# EAGLE design DS2408_8S (EAGLE 6.1)
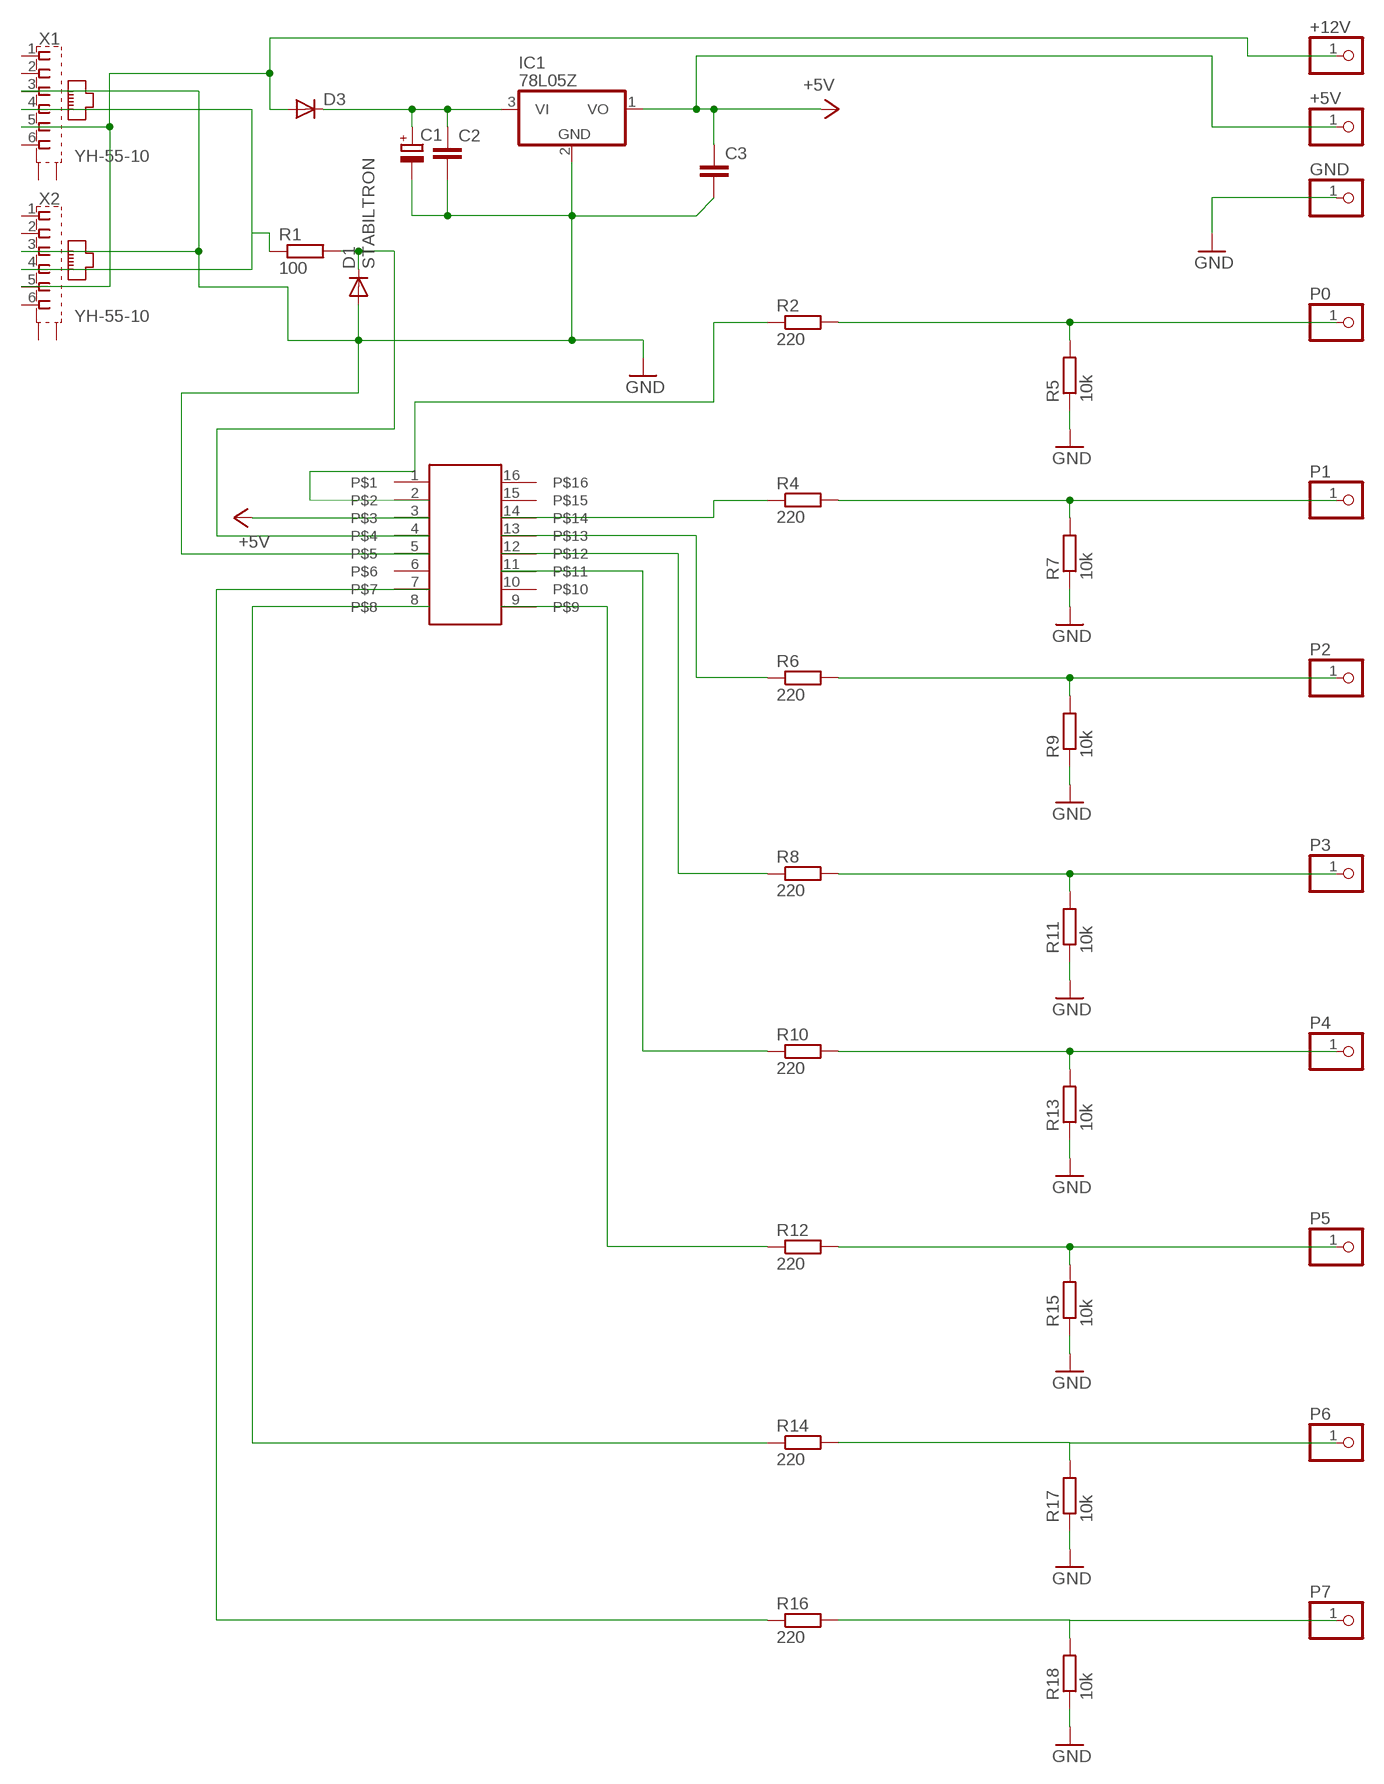
[diagram p0: schematic, sheet 1]

## Parts
+5V  PINHD-1X1  [1X01]
+12V  PINHD-1X1  [1X01]
C1  CPOL-EUE5-10.5  [E5-10,5]
C2  C-EUC1206  [C1206]
C3  C-EUC1206  [C1206]
D1  STABILTRON  1N4148DO35-10  [DO35-10]
D3  DIODE-MINIMELF  [MINIMELF]
GND  PINHD-1X1  [1X01]
IC1  78L05Z  [TO92]
P0  PINHD-1X1  [1X01]
P1  PINHD-1X1  [1X01]
P2  PINHD-1X1  [1X01]
P3  PINHD-1X1  [1X01]
P4  PINHD-1X1  [1X01]
P5  PINHD-1X1  [1X01]
P6  PINHD-1X1  [1X01]
P7  PINHD-1X1  [1X01]
R1  100  R-EU_M1206  [M1206]
R2  220  R-EU_M1206  [M1206]
R4  220  R-EU_M1206  [M1206]
R5  10k  R-EU_M1206  [M1206]
R6  220  R-EU_M1206  [M1206]
R7  10k  R-EU_M1206  [M1206]
R8  220  R-EU_M1206  [M1206]
R9  10k  R-EU_M1206  [M1206]
R10  220  R-EU_M1206  [M1206]
R11  10k  R-EU_M1206  [M1206]
R12  220  R-EU_M1206  [M1206]
R13  10k  R-EU_M1206  [M1206]
R14  220  R-EU_M1206  [M1206]
R15  10k  R-EU_M1206  [M1206]
R16  220  R-EU_M1206  [M1206]
R17  10k  R-EU_M1206  [M1206]
R18  10k  R-EU_M1206  [M1206]
U$1  DS2408S  [SO16]
X1  YH-55-10  [YH-55-10]
X2  YH-55-10  [YH-55-10]

## Nets
+5V: +5V.1 C3.1 IC1.1(VO) U$1.3
GND: C1.- C2.2 C3.2 D1.A GND.1 IC1.2(GND) R5.1 R7.1 R9.1 R11.1 R13.1 R15.1 R17.1 R18.1 U$1.5 X1.3 X2.3
N$1: P6.1 R14.2 R17.2
N$3: P1.1 R4.2 R7.2
N$4: R4.1 U$1.14
N$5: R14.1 U$1.8
N$6: P7.1 R16.2 R18.2
N$7: D1.C R1.2 U$1.4
N$8: P0.1 R2.2 R5.2
N$9: P2.1 R6.2 R9.2
N$11: R1.1 X1.4 X2.4
N$12: R12.1 U$1.9
N$13: P3.1 R8.2 R11.2
N$16: P4.1 R10.2 R13.2
N$17: P5.1 R12.2 R15.2
N$18: +12V.1 D3.A X1.5 X2.5
N$19: R6.1 U$1.13
N$20: C1.+ C2.1 D3.C IC1.3(VI)
N$25: R8.1 U$1.12
N$30: R10.1 U$1.11
N$40: R16.1 U$1.7
N$46: R2.1 U$1.2
Unconnected: U$1.1 U$1.6 U$1.10 U$1.15 U$1.16 X1.1 X1.2 X1.6 X1.S1(S) X1.S2(S) X2.1 X2.2 X2.6 X2.S1(S) X2.S2(S)

## Library data of the parts
+5V +12V GND P0 P1-P7 = pinhead:PINHD-1X1: PIN HEADER
C1 = rcl:CPOL-EU: POLARIZED CAPACITOR, European symbol
C2 C3 = rcl:C-EU: CAPACITOR, European symbol
D1 = diode:1N4148: DIODE high speed (Philips)
D3 = diode:DIODE-: DIODE
IC1 = linear:78*: Positive VOLTAGE REGULATOR Source: http://cache.national.com/ds/LM/LM78L05.pdf http://www.fairchildsemi.com/ds/LM/LM7805.pdf
R1 R2 R4-R18 = rcl:R-EU_: RESISTOR, European symbol
U$1 = barsmonster:DS2408S
X1 X2 = con-wenzhou-yihua:YH-55-10: RJ11 6 connects Source: YH-55-10.pdf

## Board
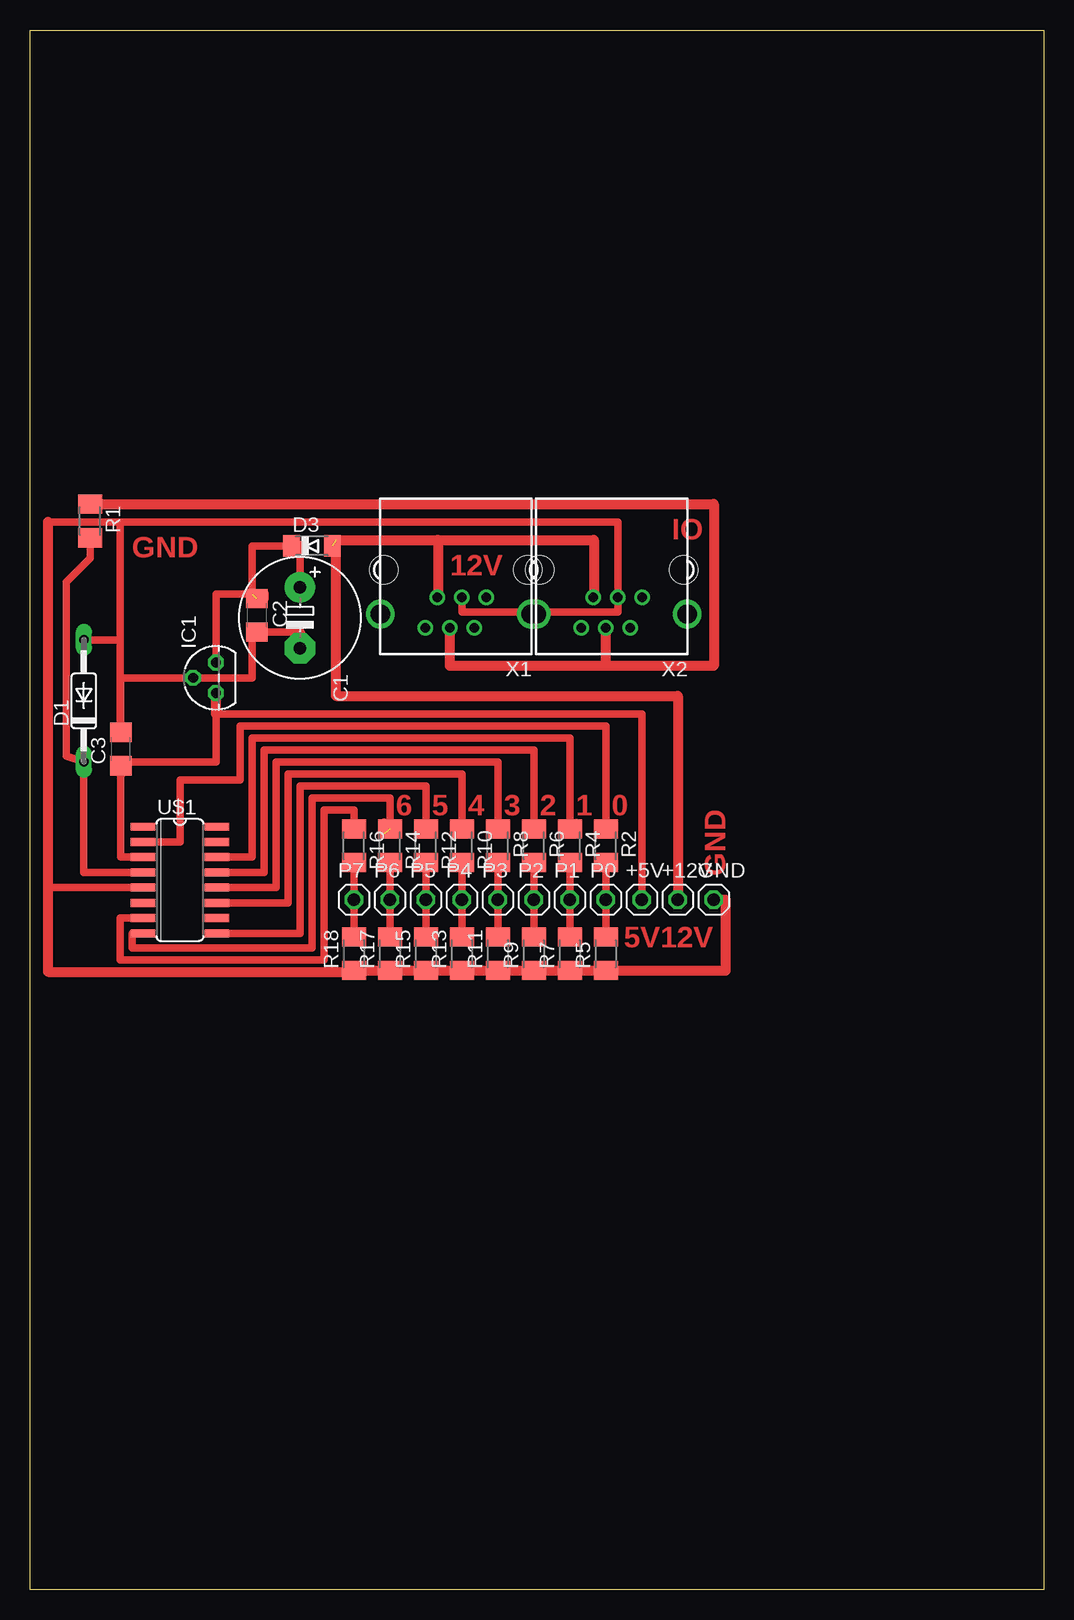
[diagram p1: board, top side]

Size 84.5 x 130 mm. Coordinates in mm from the lower left corner, seen from the top.
Outline: 84.5,0 0,0 0,130 84.5,130 84.5,0
Copper layers (1*16): Top 0.035mm / dielectric 1.5mm / Bottom 0.035mm
Design rules: minimum track width 10mil, minimum drill 24mil, track to track 8mil, track to pad 8mil, pad to pad 8mil, via to via 8mil, smd to smd 8mil, copper to edge 40mil, drill to drill 8mil, minimum pad ring 10mil, minimum via ring 8mil, stop-mask expansion 4mil, vias tented up to drill 0mil, thermal gap 10mil

### Footprints (pad centres in the part's own frame; a part is rotated, then mirrored left to right if it is on the bottom)
1X01 = drill 1.016 octagon: 1 0,0
E5-10,5 = drill 1.016 pad 2.54: + -2.54,0 | drill 1.016 pad 2.54 octagon: - 2.54,0
C1206 = smd 1.6 x 1.8: 1 -1.4,0; 2 1.4,0
DO35-10 = drill 0.813 long: A 5.08,0; C -5.08,0
MINIMELF = smd 1.4 x 1.8: A 1.7,0; C -1.7,0
TO92 = drill 0.813 octagon: 1 -1.27,0; 2 0,1.905; 3 1.27,0
M1206 = smd 1.6 x 2: 1 -1.4,0; 2 1.4,0
SO16 = smd 0.66 x 2.032: 1 -4.445,-3.073; 2 -3.175,-3.073; 3 -1.905,-3.073; 4 -0.635,-3.073; 5 0.635,-3.073; 6 1.905,-3.073; 7 3.175,-3.073; 8 4.445,-3.073; 9 4.445,3.073; 10 3.175,3.073; 11 1.905,3.073; 12 0.635,3.073; 13 -0.635,3.073; 14 -1.905,3.073; 15 -3.175,3.073; 16 -4.445,3.073
YH-55-10 = drill 0.8 pad 1.3: 1 -2.54,2.3; 2 -1.54,4.84; 3 -0.5,2.3; 4 0.5,4.84; 5 1.54,2.3; 6 2.54,4.84 | drill 1.6 pad 2.184: S1 -6.3,3.68; S2 6.3,3.68 | hole 2.36: -6,0; 6,0

### Placement (x,y rotation side)
+5V  51,57.5 0 top
+12V  54,57.5 0 top
C1  22.5,81 270 top
C2  18.91,81.21 270 top
C3  7.58,70.06 90 top
D1  4.49,74.08 90 top
D3  23.5,87 0 top
GND  57,57.5 0 top
IC1  15.5,76 90 top
P0  48,57.5 0 top
P1  45,57.5 0 top
P2  42,57.5 0 top
P3  39,57.5 0 top
P4  36,57.5 0 top
P5  33,57.5 0 top
P6  30,57.5 0 top
P7  27,57.5 0 top
R1  5,89.07 270 top
R2  48,62 270 top
R4  45,62 270 top
R5  48,53 90 top
R6  42,62 270 top
R7  45,53 90 top
R8  39,62 270 top
R9  42,53 90 top
R10  36,62 270 top
R11  39,53 90 top
R12  33,62 270 top
R13  36,53 90 top
R14  30,62 270 top
R15  33,53 90 top
R16  27,62 270 top
R17  30,53 90 top
R18  27,53 90 top
U$1  12.5,59.14 270 top
X1  35.5,85 180 top
X2  48.5,85 180 top

### Tracks (layer width: path | path; a pad name or v marks a point on that pad's centre or on a via)
+5V
  Top 0.61: U$1.3 7.58,61.05 7.58,68 C3.1 | 7.58,69 15.5,69 15.5,73 51,73 +5V.1
  Top 0.813: 15.5,73 IC1.1 | 7.58,68 7.58,69
GND
  Top 0.61: C3.2 7.58,76 IC1.2 18.5,76 18.5,79.81 | 1.5,89 7.5,89 | C2.2 22.5,79.81 | 7.5,89 7.5,79.16 | 7.5,79.16 D1.A | 7.5,79.16 7.5,71.46 | X1.3 36,81.5 49,81.5 X2.3 49,89 7.5,89 | U$1.5 1.5,58.51 1.5,59
  Top 0.813: 18.5,79.81 C2.2 | 22.5,79.81 C1.- | 7.5,71.46 C3.2 | 1.5,89 1.5,59 1.5,51.5 27,51.5 R18.1 R17.1 R15.1 R13.1 R11.1 R9.1 R7.1 R5.1 58,51.6 58,57.5 GND.1
N$1
  Top 0.61: R14.2 P6.1 R17.2
N$3
  Top 0.61: R4.2 P1.1 R7.2
N$4
  Top 0.61: 45.55,63.95 R4.1 45,71 18.5,71 18.5,61.05 U$1.14
N$5  (1 unrouted)
  Top 0.61: 29.5,63 29.5,64 | R14.1 30,66 23.5,66 23.5,53.5 8.5,53.5 8.5,54.7 U$1.8
N$6
  Top 0.61: R16.2 P7.1 R18.2
N$7
  Top 0.61: R1.2 5,86 3,84 3,69.49 D1.C 4.49,59.77 U$1.4
N$8
  Top 0.61: R2.2 P0.1 R5.2
N$9
  Top 0.61: R6.2 P2.1 R9.2
N$11
  Top 0.813: X1.4 35,77 48,77 | 48,77 57,77 57,90.5 5,90.5 R1.1 | 48,77 X2.4
N$12
  Top 0.61: U$1.9 22.5,54.7 22.5,67 33,67 R12.1
N$13
  Top 0.61: R8.2 P3.1 R11.2
N$16
  Top 0.61: R10.2 P4.1 R13.2
N$17
  Top 0.61: R12.2 P5.1 R15.2
N$18  (1 unrouted)
  Top 0.61: D3.A 25,87 | 47,82.7 X2.5
  Top 0.813: 47,82.7 47,87.5 34,87.5 | 34,87.5 25.5,87.5 25.5,74.5 54,74.5 +12V.1 | X1.5 34,82.7 34,87.5
N$19
  Top 0.61: U$1.13 19.5,59.77 19.5,70 42,70 R6.1
N$20  (1 unrouted)
  Top 0.61: IC1.3 15.5,83 18.5,83 18.5,87 D3.C | 22.5,87 C1.+
  Top 0.813: D3.C 22.5,87 | C2.1 19.5,82.61 19.5,83
N$25
  Top 0.61: U$1.12 20.5,58.51 20.5,69 39,69 R8.1
N$30
  Top 0.61: U$1.11 21.5,57.23 21.5,68 36,68 R10.1
N$40
  Top 0.61: U$1.7 7.5,55.97 7.5,52.5 24.5,52.5 24.5,65 27,65 R16.1
N$46
  Top 0.61: U$1.2 12.5,62.31 12.5,67.5 17.5,67.5 17.5,72 48,72 R2.1

### Text on the board
Top: IO | GND | 12V | 6 | 5 | 4 | 3 | 2 | 1 | 0 | GND | 5V12V